# EAGLE board FLYTE 3.01 (EAGLE 9.6.2)
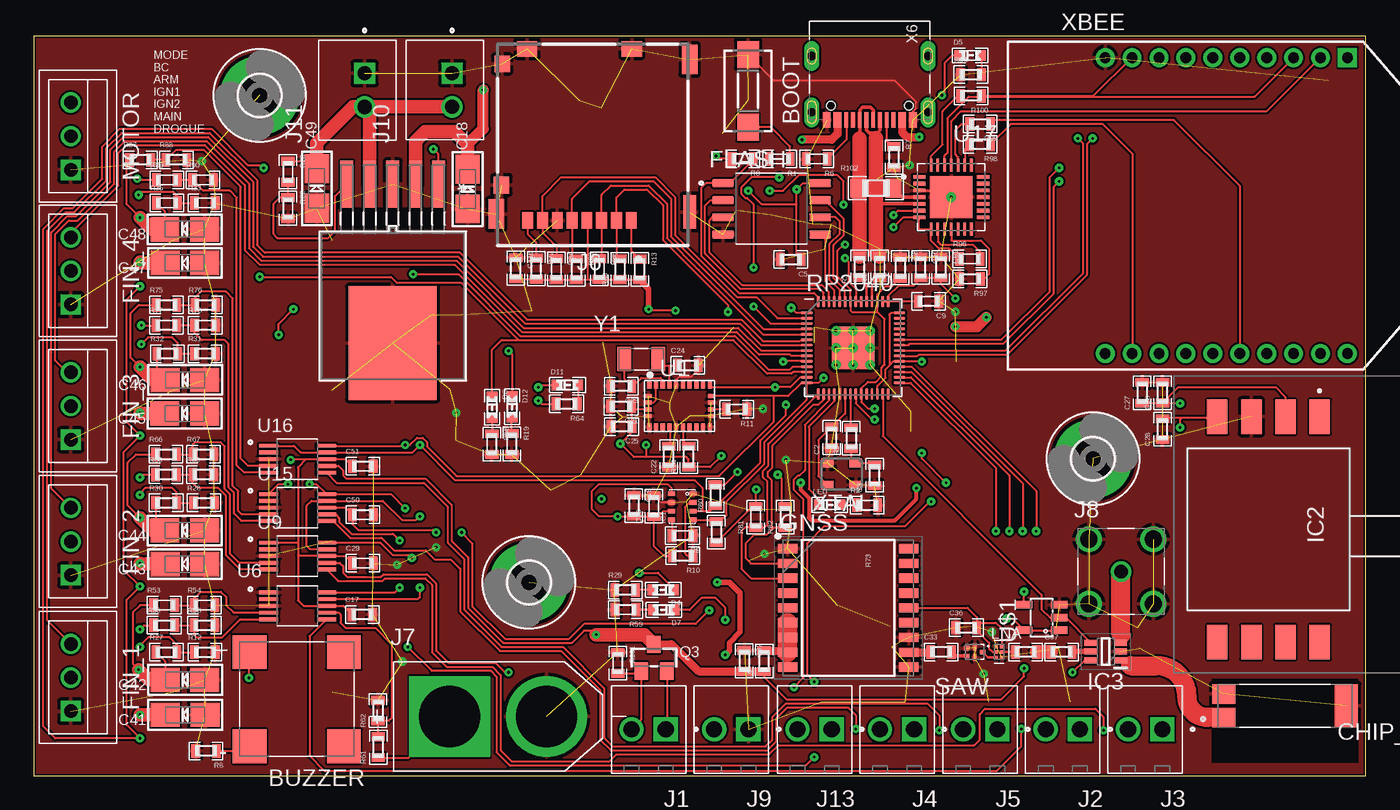
[diagram p7: board, top side]
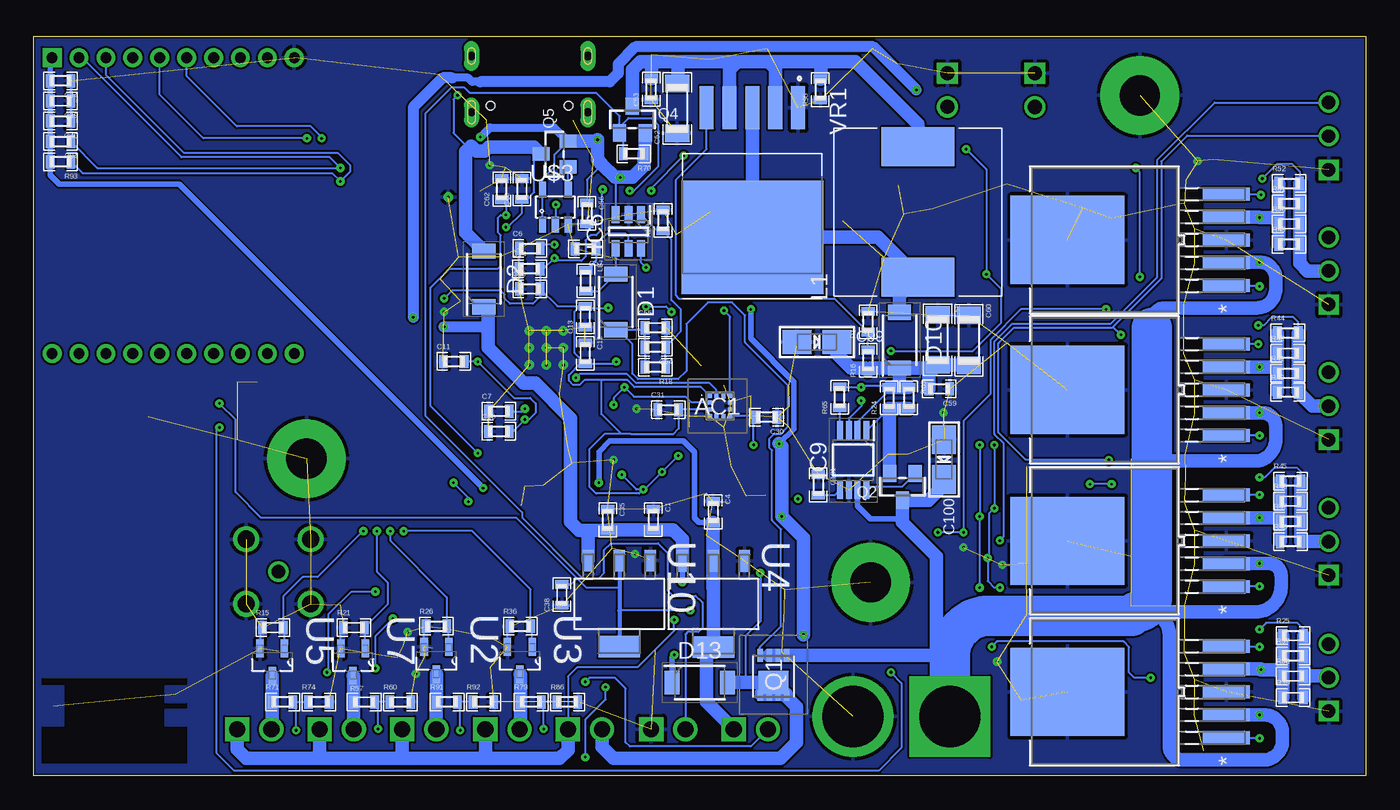
[diagram p8: board, bottom side, seen from below]

Size 99 x 55 mm. Coordinates in mm from the lower left corner, seen from the top.
Outline: 0,0 99,0 99,55 0,55 0,0
Copper layers (1*16): Top 0.075mm / dielectric 1.5mm / Bottom 0.075mm
Design rules "default *": minimum track width 0.149859375mm, minimum drill 0.1mm, track to track 0.149859375mm, track to pad 0.149859375mm, pad to pad 0.149859375mm, via to via 0.149859375mm, smd to smd 0.149859375mm, copper to edge 0.149859375mm, drill to drill 6mil, minimum pad ring 10mil, minimum via ring 8mil, stop-mask expansion 4mil, vias tented up to drill 0mil, thermal gap 10mil
Net classes: 1 power: width 0.305 mm

## Footprints (pad centres in the part's own frame; a part is rotated, then mirrored left to right if it is on the bottom)
KX1341211 = smd 0.35 x 0.3: 1 -0.762,0.75; 2 -0.762,0.25; 3 -0.762,-0.25; 4 -0.762,-0.75; 7 0.762,-0.75; 8 0.762,-0.25; 9 0.762,0.25; 10 0.762,0.75 | smd 0.3 x 0.35: 5 -0.25,-0.75; 6 0.25,-0.75; 11 0.25,0.75; 12 -0.25,0.75
DTSM-3 = smd 2 x 1.6: 1 -2.7,0; 2 2.7,0
CUI_CMT-8530S-SMT = smd 2.5 x 2.5: 1 -3.5,3.5; 2 -3.5,-3.5; N 3.5,3.5; P 3.5,-3.5
0603 = smd 0.65 x 1: 1 -0.775,0; 2 0.775,0
EIA3216-18/A-W = smd 2.15 x 1.8: + 1.475,0; - -1.475,0
1206 = smd 1.3 x 1.8: 1 -1.85,0; 2 1.85,0
XCVR_W3010 = smd 1.7 x 1.45: 1 4.55,0.875; 2 4.55,-0.875 | smd 1.7 x 3.2: 3 -4.55,0
SODFL4725X105N = smd 1.12 x 1.72: 1 -2.075,0; 2 2.075,0
0603.LED = smd 0.8 x 0.8: P$1 -0.775,0; P$2 0.775,0
B3B-XH = drill 1 square: P$1 2.5,0 | drill 1: P$2 0,0; P$3 -2.5,0
SOIC127P790X216-8N = smd 1.61 x 0.58: 1 -3.605,1.905; 2 -3.605,0.635; 3 -3.605,-0.635; 4 -3.605,-1.905; 5 3.605,-1.905; 6 3.605,-0.635; 7 3.605,0.635; 8 3.605,1.905
SON110P970X1010X230-18N = smd 1.45 x 0.686: 1 -4.5,4.4; 2 -4.5,3.3; 3 -4.5,2.2; 4 -4.5,1.1; 5 -4.5,0; 6 -4.5,-1.1; 7 -4.5,-2.2; 8 -4.5,-3.3; 9 -4.5,-4.4; 10 4.5,-4.4; 11 4.5,-3.3; 12 4.5,-2.2; 13 4.5,-1.1; 14 4.5,0; 15 4.5,1.1; 16 4.5,2.2; 17 4.5,3.3; 18 4.5,4.4
3,0-PAD = drill 3 pad 5.842: B3,0 0,0
BMP280 = smd 0.35 x 0.5: 1 0.975,-0.8; 2 0.325,-0.8; 3 -0.325,-0.8; 4 -0.975,-0.8; 5 -0.975,0.8; 6 -0.325,0.8; 7 0.325,0.8; 8 0.975,0.8
MPXV5100DP = smd 2.54 x 1.52: 1 8.38,-3.81; 2 8.38,-1.27; 3 8.38,1.27; 4 8.38,3.81; 5 -8.38,3.81; 6 -8.38,1.27; 7 -8.38,-1.27; 8 -8.38,-3.81
SOT65P220X100-6N = smd 0.95 x 0.45: 1 -1.1,0.65; 2 -1.1,0; 3 -1.1,-0.65; 4 1.1,-0.65; 5 1.1,0; 6 1.1,0.65
SOT95P280X145-6N = smd 1.25 x 0.6: 1 -1.25,0.95; 2 -1.25,0; 3 -1.25,-0.95; 4 1.25,-0.95; 5 1.25,0; 6 1.25,0.95
SOP65P490X110-8N = smd 1.4 x 0.45: 1 -2.2,0.975; 2 -2.2,0.325; 3 -2.2,-0.325; 4 -2.2,-0.975; 5 2.2,-0.975; 6 2.2,-0.325; 7 2.2,0.325; 8 2.2,0.975
TE_282834-2 = drill 1.2 square: 1 -1.27,0 | drill 1.2: 2 1.27,0
5031821852 = smd 0.8 x 1.24: 1 -2.85,0.63; 2 -1.75,0.63; 3 -0.65,0.63; 4 0.45,0.63; 5 1.55,0.63; 6 2.65,0.63; 7 3.75,0.63; 8 4.85,0.63 | smd 0.95 x 2.5: 9 -7.195,0 | smd 1.15 x 2.2: 10 7.195,0.15; 15 -7.195,-11.33 | smd 1.16 x 1.25: 11 6.795,-2 | smd 1.16 x 1.2: 12 6.74,-11 | smd 1.5 x 1.15: 13 4.89,-12.125; 14 -2.89,-12.125
AMASS_XT60-M = drill 4.55 pad 6: N 3.6,0 | drill 4.55 pad 6 square: P -3.6,0
LPRS_SMA_CONNECTOR = drill 1: 1 0,0 | drill 1.28: G1 -2.4,2.4; G2 -2.4,-2.4; G3 2.4,-2.4; G4 2.4,2.4
JST_B2B-XH-A(LF)(SN) = drill 1.05 square: 1 1.25,-0.525 | drill 1.05: 2 -1.25,-0.525
INDP125125X600N = smd 2.9 x 5.4: 1 -4.85,0; 2 4.85,0
AMP_BGA725L6E6327FTSA1 = smd 0.25 x 0.25: 1 -0.2,0.4; 2 -0.2,0; 3 -0.2,-0.4; 4 0.2,-0.4; 5 0.2,0; 6 0.2,0.4
SIS862DNT1GE3 = smd 0.99 x 0.405: 1 -1.555,0.992; 2 -1.555,0.332; 3 -1.555,-0.328; 4 -1.555,-0.988 | smd 0.51 x 0.405: 5 1.555,-0.988; 6 1.555,-0.328; 7 1.555,0.332; 8 1.555,0.992 | smd 1.725 x 2.235: 9 0.438,0.002 | smd 0.25 x 0.2: 10 1.175,-1.096; 11 1.175,1.096
SOT23-WIDE = smd 1 x 1.27: 1 -0.95,-1; 2 0.95,-1; 3 0,1
0805 = smd 1.2 x 1.4: 1 -1.3,0; 2 1.3,0
RP2040-QFN-56 = smd 0.875 x 0.2: 1 -3.438,2.6; 2 -3.438,2.2; 3 -3.438,1.8; 4 -3.438,1.4; 5 -3.438,1; 6 -3.438,0.6; 7 -3.438,0.2; 8 -3.438,-0.2; 9 -3.438,-0.6; 10 -3.438,-1; 11 -3.438,-1.4; 12 -3.438,-1.8; 13 -3.438,-2.2; 14 -3.438,-2.6; 29 3.438,-2.6; 30 3.438,-2.2; 31 3.438,-1.8; 32 3.438,-1.4; 33 3.438,-1; 34 3.438,-0.6; 35 3.438,-0.2; 36 3.438,0.2; 37 3.438,0.6; 38 3.438,1; 39 3.438,1.4; 40 3.438,1.8; 41 3.438,2.2; 42 3.438,2.6 | smd 0.2 x 0.875: 15 -2.6,-3.438; 16 -2.2,-3.438; 17 -1.8,-3.438; 18 -1.4,-3.438; 19 -1,-3.438; 20 -0.6,-3.438; 21 -0.2,-3.438; 22 0.2,-3.438; 23 0.6,-3.438; 24 1,-3.438; 25 1.4,-3.438; 26 1.8,-3.438; 27 2.2,-3.438; 28 2.6,-3.438; 43 2.6,3.438; 44 2.2,3.438; 45 1.8,3.438; 46 1.4,3.438; 47 1,3.438; 48 0.6,3.438; 49 0.2,3.438; 50 -0.2,3.438; 51 -0.6,3.438; 52 -1,3.438; 53 -1.4,3.438; 54 -1.8,3.438; 55 -2.2,3.438; 56 -2.6,3.438 | smd 3.2 x 3.2: 57 0,0 | drill 0.2 pad 0.55: 58 -1.275,1.275; 59 0,1.275; 60 1.275,1.275 | drill 0.2 pad 0.6: 61 -1.275,0; 62 0,0; 63 1.275,0; 64 -1.275,-1.275; 65 0,-1.275; 66 1.275,-1.275
FIL_AFS14A04-1575.42-T3 = smd 0.425 x 0.325: A 0.588,0.287; C -0.588,0; E 0.588,-0.287 | smd 0.25 x 0.525: B 0,0.388; D 0,-0.388
LGA28R50P4X10_380X520X100 = smd 0.3 x 0.525: 1 -2.25,1.562; 6 -2.25,-1.562; 7 -1.75,-1.562; 8 -1.25,-1.562; 9 -0.75,-1.562; 10 -0.25,-1.562; 11 0.25,-1.562; 12 0.75,-1.562; 13 1.25,-1.562; 14 1.75,-1.562; 15 2.25,-1.562; 20 2.25,1.562; 21 1.75,1.562; 22 1.25,1.562; 23 0.75,1.562; 24 0.25,1.562; 25 -0.25,1.562; 26 -0.75,1.562; 27 -1.25,1.562; 28 -1.75,1.562 | smd 0.425 x 0.3: 2 -2.312,0.75; 3 -2.312,0.25; 4 -2.312,-0.25; 5 -2.312,-0.75; 16 2.312,-0.75; 17 2.312,-0.25; 18 2.312,0.25; 19 2.312,0.75
SOT91P240X120-3N = smd 1.321 x 0.559: 1 -1.016,0.914; 2 -1.016,-0.914; 3 1.016,0
SOT230 = smd 1.6 x 0.838: 1 -3.2,2.311; 2 -3.2,0; 3 -3.2,-2.311 | smd 1.6 x 3.099: 4 3.2,0
SOP50P490X110-10N = smd 1.47 x 0.28: 1 -2.15,1; 2 -2.15,0.5; 3 -2.15,0; 4 -2.15,-0.5; 5 -2.15,-1; 6 2.15,-1; 7 2.15,-0.5; 8 2.15,0; 9 2.15,0.5; 10 2.15,1
TO-263-5_MCH = smd 0.965 x 3.505: 1 -3.404,-9.055; 2 -1.702,-9.055; 3 0,-9.055; 4 1.702,-9.055; 5 3.404,-9.055 | smd 6.553 x 8.458: 6 0,2.743
QFN50P500X500X100-29N = smd 0.97 x 0.26: 1 -2.37,1.5; 2 -2.37,1; 3 -2.37,0.5; 4 -2.37,0; 5 -2.37,-0.5; 6 -2.37,-1; 7 -2.37,-1.5; 15 2.37,-1.5; 16 2.37,-1; 17 2.37,-0.5; 18 2.37,0; 19 2.37,0.5; 20 2.37,1; 21 2.37,1.5 | smd 0.26 x 0.97: 8 -1.5,-2.37; 9 -1,-2.37; 10 -0.5,-2.37; 11 0,-2.37; 12 0.5,-2.37; 13 1,-2.37; 14 1.5,-2.37; 22 1.5,2.37; 23 1,2.37; 24 0.5,2.37; 25 0,2.37; 26 -0.5,2.37; 27 -1,2.37; 28 -1.5,2.37 | smd 3.15 x 3.15: 29 0,0 | drill 0.2: P$1 0,0
SOT23-5 = smd 0.55 x 1.2: 1 -0.95,-1.3; 2 0,-1.3; 3 0.95,-1.3; 4 0.95,1.3; 5 -0.95,1.3
DPAK170P1435X465-6N = smd 3.21 x 1.05: 1 -6.13,3.4; 2 -6.13,1.7; 3 -6.13,0; 4 -6.13,-1.7; 5 -6.13,-3.4 | smd 8.46 x 10.53: 6 3.5,0
USB_C_CUSB31-CFM2AX-01-X = smd 0.575 x 1.15: A1B12 -3.2,3.545; A4B9 -2.4,3.545; B1A12 3.2,3.545; B4A9 2.4,3.545 | smd 0.275 x 1.15: A5 -1.25,3.545; A6 -0.25,3.545; A7 0.25,3.545; A8 1.25,3.545; B5 1.75,3.545; B6 0.75,3.545; B7 -0.75,3.545; B8 -1.75,3.545 | drill 0.6 pad 1 long: M1 -4.32,2.97; M2 4.32,2.97; M3 -4.32,-1.21; M4 4.32,-1.21 | hole 0.65: 2.89,2.47; -2.89,2.47
DIP2200W51P200L3294H279Q20P = drill 0.8 pad 1.4 square: 1 -11,8.75 | drill 0.8 pad 1.4: 2 -11,6.75; 3 -11,4.75; 4 -11,2.75; 5 -11,0.75; 6 -11,-1.25; 7 -11,-3.25; 8 -11,-5.25; 9 -11,-7.25; 10 -11,-9.25; 11 11,-9.25; 12 11,-7.25; 13 11,-5.25; 14 11,-3.25; 15 11,-1.25; 16 11,0.75; 17 11,2.75; 18 11,4.75; 19 11,6.75; 20 11,8.75
ASE = smd 0.9 x 0.65: 1 -1.05,-0.825; 2 1.05,-0.825; 3 1.05,0.825; 4 -1.05,0.825
XTAL_FC-135_32.7680KA-A0 = smd 1 x 1.8: 1 -1.25,0; 2 1.25,0

## Placement (x,y rotation side)
AC1  KX134-1211  [KX1341211]  48,27.5 0 bottom
BOOT  DTSM-3  [DTSM-3]  53.09,50.92 270 top
BUZZER  BUZZER  [CUI_CMT-8530S-SMT]  19.55,5.71 180 top
C1  [0603]  52.95,19.06 270 bottom
C2  24 pF  [0603]  59.29,25.16 90 top
C3  24 pF  [0603]  62.49,22.35 90 top
C4  [0603]  48.5,19.63 270 bottom
C5  100 nF  [0603]  56.26,38.39 180 top
C6  100 nF  [0603]  62.13,39.21 0 bottom
C7  100 nF  [0603]  64.42,27.11 0 bottom
C8  1 uF  [0603]  64.41,37.79 270 top
C9  100 nF  [0603]  66.5,35.29 180 top
C10  1 uF  [0603]  65.91,37.81 270 top
C11  100 nF  [0603]  67.78,30.81 0 bottom
C12  100 nF  [0603]  58.01,31.43 270 bottom
C13  100 nF  [0603]  58.01,34.14 90 bottom
C14  100 nF  [0603]  62.15,37.71 0 bottom
C15  100 nF  [0603]  62.14,36.21 0 bottom
C16  100 nF  [0603]  64.43,25.61 0 bottom
C17  0.1 uF  [0603]  24.42,12.01 0 top
C18  10uF  [EIA3216-18/A-W]  32.25,43.63 90 top
C19  100 nF  [0603]  44.61,20.09 270 top
C20  100 nF  [0603]  46.08,20.06 90 top
C21  100 nF  [0603]  43.65,27.48 180 top
C22  100 nF  [0603]  47.18,23.74 90 top
C23  25 pF  [0603]  43.67,28.98 180 top
C24  25 pF  [0603]  48.62,30.52 0 top
C25  100 nF  [0603]  43.69,25.98 180 top
C26  1 uF  [0603]  83.88,28.5 90 top
C27  10 nF  [0603]  82.38,28.49 90 top
C28  470 pF  [0603]  83.88,25.78 90 top
C29  0.1 uF  [0603]  24.47,15.82 0 top
C30  0.1 uF  [0603]  44.54,26.68 180 bottom
C31  0.1 uF  [0603]  51.85,27.22 0 bottom
C32  10 nF  [0603]  52.82,8.56 270 top
C33  120 pF  [0603]  67.43,9.22 0 top
C34  47pF  [0603]  97,51.68 180 bottom
C35  [0603]  56.35,19.04 270 bottom
C36  1 nF  [0603]  69.31,11.02 0 top
C37  120 pF  [0603]  76.4,9.22 0 top
C38  [0603]  59.75,13.47 90 bottom
C39  1uF  [0603]  97,50.18 180 bottom
C40  10uF  [0603]  97,48.68 180 bottom
C41  10uF  [EIA3216-18/A-W]  11.26,4.55 180 top
C42  10 uF  [EIA3216-18/A-W]  11.25,7.15 180 top
C43  10uF  [EIA3216-18/A-W]  11.24,15.75 180 top
C44  10 uF  [EIA3216-18/A-W]  11.23,18.25 180 top
C45  10uF  [EIA3216-18/A-W]  11.22,26.95 180 top
C46  10 uF  [EIA3216-18/A-W]  11.25,29.44 180 top
C47  10uF  [EIA3216-18/A-W]  11.24,38.14 180 top
C48  10 uF  [EIA3216-18/A-W]  11.23,40.64 180 top
C49  10 uF  [EIA3216-18/A-W]  21.04,43.68 90 top
C50  0.1 uF  [0603]  24.47,19.42 0 top
C51  0.1 uF  [0603]  24.46,23.02 0 top
C52  100 uF  [1206]  51.18,49.63 90 bottom
C53  1 uF  [0603]  53.12,51.05 90 bottom
C54  10 pF  [0603]  52.8,31.88 180 bottom
C55  1 uF  [0603]  52.8,33.32 0 bottom
C56  1 uF  [0603]  57.88,41.82 270 bottom
C57  4.7 uF  [0603]  57.99,39.18 180 bottom
C58  100 uF  [1206]  31.82,32.42 270 bottom
C59  1 uF  [0603]  31.7,28.78 180 bottom
C60  100 uF  [1206]  29.5,32.39 270 bottom
C61  100 nF  [0603]  67.42,37.81 270 top
C62  4.7 uF  [0603]  64.22,43.62 90 bottom
C63  1 uF  [0603]  62.72,43.63 90 bottom
C99  10uF  [EIA3216-18/A-W]  40.79,32.26 0 bottom
C100  10uF  [EIA3216-18/A-W]  31.35,23.52 270 bottom
C101  0.1 uF  [0603]  40.68,21.64 270 bottom
C115  1 uF  [0603]  35.82,37.75 270 top
CHIP_ANT  W3010  [XCVR_W3010]  93,5.22 180 top
D1  RSX501LAM20TR  [SODFL4725X105N]  55.74,35.24 90 bottom
D2  RSX501LAM20TR  [SODFL4725X105N]  65.54,36.95 90 bottom
D4  [0603.LED]  46.79,13.84 180 top
D5  [0603.LED]  69.6,53.56 0 top
D6  [0603.LED]  34.06,27.41 270 top
D7  [0603.LED]  46.82,12.34 180 top
D10  RSX501LAM20TR  [SODFL4725X105N]  34.65,32.39 90 bottom
D11  [0603.LED]  39.67,29.06 0 top
D12  [0603.LED]  35.56,27.44 270 top
D13  RSX501LAM20TR  [SODFL4725X105N]  49.5,6.95 0 bottom
FIN_1  03-JST-B3B-XH-A  [B3B-XH]  2.76,7.32 270 top
FIN_2  03-JST-B3B-XH-A  [B3B-XH]  2.76,17.43 270 top
FIN_3  03-JST-B3B-XH-A  [B3B-XH]  2.76,27.5 270 top
FIN_4  03-JST-B3B-XH-A  [B3B-XH]  2.76,37.55 270 top
FLASH  W25Q128JVSIQ  [SOIC127P790X216-8N]  54.84,42.16 0 top
GNSS  TESEO-LIV3F  [SON110P970X1010X230-18N]  60.53,12.5 0 top
H2  MOUNT-PAD-ROUND3.0  [3,0-PAD]  16.8,50.59 0 top
H3  MOUNT-PAD-ROUND3.0  [3,0-PAD]  36.81,14.39 0 top
H4  MOUNT-PAD-ROUND3.0  [3,0-PAD]  78.72,23.59 0 top
IC1  BMP280  [BMP280]  48.2,20.01 90 top
IC2  MPXV5100DP  [MPXV5100DP]  91.76,18.33 90 top
IC3  AS179-92LF  [SOT65P220X100-6N]  79.67,9.25 180 top
IC6  MAX8574EUT+T  [SOT95P280X145-6N]  54.8,40.47 270 bottom
IC9  MCP73844-840I_MS  [SOP65P490X110-8N]  38.1,23.48 270 bottom
J1  282834-2  [TE_282834-2]  45.7,3.47 180 top
J2  282834-2  [TE_282834-2]  76.48,3.47 180 top
J3  282834-2  [TE_282834-2]  82.6,3.47 180 top
J4  282834-2  [TE_282834-2]  64.16,3.47 180 top
J5  282834-2  [TE_282834-2]  70.35,3.47 180 top
J6  503182-1852  [5031821852]  41.56,41.93 180 top
J7  XT60-M  [AMASS_XT60-M]  34.51,4.42 0 top
J8  SMA_CONNECTOR  [LPRS_SMA_CONNECTOR]  80.81,15.2 0 top
J9  282834-2  [TE_282834-2]  51.84,3.47 180 top
J10  B2B-XH-A(LF)(SN)  [JST_B2B-XH-A(LF)(SN)]  30.57,50.99 90 top
J11  B2B-XH-A(LF)(SN)  [JST_B2B-XH-A(LF)(SN)]  24.07,50.98 90 top
J13  282834-2  [TE_282834-2]  58.03,3.47 180 top
L1  33 uH  [INDP125125X600N]  33.29,41.92 90 bottom
L6  27 nH  [0603]  54.28,8.54 90 top
L7  5.6 nH  [0603]  73.73,9.22 0 top
L8  22 uH  [0603]  57.98,36.82 270 bottom
LED  [0603.LED]  59.15,20.16 0 top
LNA  BGA725L6  [AMP_BGA725L6E6327FTSA1]  71.74,9.22 0 top
MOTOR  03-JST-B3B-XH-A  [B3B-XH]  2.76,47.56 270 top
Q1  SI7625DN-T1-GE3  [SIS862DNT1GE3]  44.02,7.41 270 bottom
Q2  [SOT23-WIDE]  34.44,21.5 180 bottom
Q3  [SOT23-WIDE]  46.1,8.8 0 top
Q4  [SOT23-WIDE]  54.51,48.8 0 bottom
Q5  [SOT23-WIDE]  60.3,46.24 90 bottom
R0  10k ohm  [0603]  52.69,45.88 180 top
R1  1k ohm  [0603]  55.44,45.87 180 top
R2  60 ohm  [0603]  61.95,20.13 0 top
R3  27.4 ohm  [0603]  61.37,37.84 90 top
R4  27.4 ohm  [0603]  62.87,37.83 90 top
R5  1k ohm  [0603]  60.77,25.12 90 top
R6  5.1k ohm  [0603]  58.19,45.87 180 top
R7  5.1k ohm  [0603]  63.93,46 270 top
R8  100 ohm  [0603]  12.81,1.87 180 top
R9  10k ohm  [0603]  48.22,17.87 180 top
R10  10k ohm  [0603]  48.23,16.37 180 top
R11  10 kohm  [0603]  52.24,27.27 180 top
R12  100k ohm  [0603]  12.72,9.2 0 top
R13  10k ohm  [0603]  45.03,37.65 270 top
R14  10 kohm  [0603]  48.67,23.74 90 top
R15  10k ohm  [0603]  81.23,11.03 0 bottom
R16  365k ohm  [0603]  37,30.89 90 bottom
R17  57.6k ohm  [0603]  37,33.77 90 bottom
R18  100k ohm  [0603]  52.8,30.4 180 bottom
R19  60 ohm  [0603]  35.53,24.68 270 top
R20  10k ohm  [0603]  52.23,41.29 90 bottom
R21  10k ohm  [0603]  75.2,11.03 0 bottom
R22  100k ohm  [0603]  18.9,42.21 270 top
R23  301k ohm  [0603]  18.9,44.92 270 top
R24  0.1 ohm  [0603]  35.43,28.11 90 bottom
R25  0.13 ohm  [0603]  5.4,10.43 0 bottom
R26  10k ohm  [0603]  69.07,11.13 0 bottom
R27  301k ohm  [0603]  9.87,9.2 0 top
R28  100k ohm  [0603]  12.66,20.3 0 top
R29  315 ohm  [0603]  43.96,13.83 0 top
R30  301k ohm  [0603]  9.85,20.3 0 top
R31  100k ohm  [0603]  12.74,31.4 0 top
R32  301k ohm  [0603]  9.93,31.4 0 top
R33  100k ohm  [0603]  12.72,42.6 0 top
R34  158 ohm  [0603]  69.65,52.13 0 top
R35  301k ohm  [0603]  9.91,42.6 0 top
R36  10k ohm  [0603]  62.84,11.13 0 bottom
R37  0.13 ohm  [0603]  5.4,8.93 0 bottom
R38  0.13 ohm  [0603]  5.4,7.43 0 bottom
R39  0.13 ohm  [0603]  5.4,5.83 0 bottom
R40  0.13 ohm  [0603]  5.8,28.53 0 bottom
R41  0.13 ohm  [0603]  5.8,29.93 0 bottom
R42  0.13 ohm  [0603]  5.8,31.43 0 bottom
R43  10k ohm  [0603]  43.57,37.67 90 top
R44  0.13 ohm  [0603]  5.8,32.93 0 bottom
R45  0.13 ohm  [0603]  5.6,21.93 0 bottom
R46  0.13 ohm  [0603]  5.6,20.43 0 bottom
R47  0.13 ohm  [0603]  5.6,18.93 0 bottom
R48  0.13 ohm  [0603]  5.6,17.43 0 bottom
R49  0.13 ohm  [0603]  5.7,39.53 0 bottom
R50  0.13 ohm  [0603]  5.7,41.04 0 bottom
R51  0.13 ohm  [0603]  5.7,42.54 0 bottom
R52  0.13 ohm  [0603]  5.7,44.04 0 bottom
R53  100k ohm  [0603]  9.7,12.7 0 top
R54  140k ohm  [0603]  12.69,12.7 0 top
R55  100k ohm  [0603]  9.7,11.2 0 top
R56  140k ohm  [0603]  12.69,11.2 0 top
R57  100k ohm  [0603]  74.44,5.5 0 bottom
R58  60 ohm  [0603]  34.04,24.67 270 top
R59  315 ohm  [0603]  43.98,12.36 180 top
R60  140k ohm  [0603]  71.75,5.5 0 bottom
R61  100k ohm  [0603]  25.6,2.14 90 top
R62  140k ohm  [0603]  25.59,4.86 90 top
R63  0.1 ohm  [0603]  33.96,28.11 270 bottom
R64  158 ohm  [0603]  39.6,27.66 180 top
R65  100k ohm  [0603]  39.11,28.15 90 bottom
R66  100k ohm  [0603]  9.84,23.91 0 top
R67  140k ohm  [0603]  12.63,23.91 0 top
R68  100k ohm  [0603]  9.82,22.41 0 top
R69  140k ohm  [0603]  12.61,22.41 0 top
R70  10k ohm  [0603]  54.41,46.26 180 bottom
R71  100k ohm  [0603]  80.5,5.51 0 bottom
R72  10k ohm  [0603]  37.34,37.72 270 top
R73  10k ohm  [0603]  50.74,18.13 270 top
R74  140k ohm  [0603]  77.81,5.51 0 bottom
R75  100k ohm  [0603]  9.88,35.01 0 top
R76  140k ohm  [0603]  12.77,35.01 0 top
R77  100k ohm  [0603]  9.86,33.51 0 top
R78  140k ohm  [0603]  12.75,33.51 0 top
R79  100k ohm  [0603]  62.04,5.51 0 bottom
R80  10k ohm  [0603]  50.66,20.86 90 top
R81  10k ohm  [0603]  53.66,19.25 90 top
R82  10k ohm  [0603]  55.86,19.24 90 top
R83  10k ohm  [0603]  40.34,37.67 270 top
R84  10k ohm  [0603]  38.84,37.68 270 top
R85  10k ohm  [0603]  42.04,37.69 270 top
R86  140k ohm  [0603]  59.33,5.51 0 bottom
R87  100k ohm  [0603]  7.92,45.81 0 top
R88  140k ohm  [0603]  10.61,45.81 0 top
R89  100k ohm  [0603]  9.9,44.31 0 top
R90  140k ohm  [0603]  12.59,44.31 0 top
R91  100k ohm  [0603]  68.28,5.51 0 bottom
R92  140k ohm  [0603]  65.57,5.51 0 bottom
R93  10k ohm  [0603]  97,45.66 180 bottom
R94  10k ohm  [0603]  97,47.16 180 bottom
R95  10k ohm  [0603]  40.54,51.02 90 bottom
R96  10k ohm  [0603]  69.57,38.44 0 top
R97  [0603]  69.58,36.95 180 top
R98  0 ohm  [0603]  70.34,46.96 180 top
R99  0 ohm  [0603]  70.35,48.46 180 top
R100  0 ohm  [0603]  69.66,50.56 180 top
R101  10k ohm  [0603]  43.4,8.4 270 top
R102  [0805]  62.6,43.7 0 top
RP2040  RP2040-QFN56  [RP2040-QFN-56]  60.9,31.83 0 top
SAW  SAW_FILTER  [FIL_AFS14A04-1575.42-T3]  69.93,9.22 180 top
U1  BNO055  [LGA28R50P4X10_380X520X100]  48,27.5 0 top
U2  CJ3400  [SOT91P240X120-3N]  69.07,8.58 270 bottom
U3  CJ3400  [SOT91P240X120-3N]  62.87,8.58 270 bottom
U4  LM1117-3.3  [SOT230]  48.48,12.79 270 bottom
U5  CJ3400  [SOT91P240X120-3N]  81.27,8.48 270 bottom
U6  ADS1115IDGSR  [SOP50P490X110-10N]  19.61,12.65 0 top
U7  CJ3400  [SOT91P240X120-3N]  75.27,8.48 270 bottom
U8  MIC29302WU-TR  [TO-263-5_MCH]  19.43,6.25 90 bottom
U9  ADS1115IDGSR  [SOP50P490X110-10N]  19.61,16.35 0 top
U10  LM1117-3.3  [SOT230]  55.48,12.81 270 bottom
U11  MIC29302WU-TR  [TO-263-5_MCH]  19.43,17.48 90 bottom
U12  MIC29302WU-TR  [TO-263-5_MCH]  19.43,28.71 90 bottom
U13  MIC29302WU-TR  [TO-263-5_MCH]  19.43,39.85 90 bottom
U14  MIC29302WU-TR  [TO-263-5_MCH]  26.68,34.93 180 top
U15  ADS1115IDGSR  [SOP50P490X110-10N]  19.61,19.95 0 top
U16  ADS1115IDGSR  [SOP50P490X110-10N]  19.61,23.55 0 top
U17  CP2102  [QFN50P500X500X100-29N]  68.19,43.03 0 top
U$1  SN74LVC1G04DBVR  [SOT23-5]  74.91,11.78 90 top
U$3  SN74LVC1G04DBVR  [SOT23-5]  60.23,42.29 0 bottom
VR1  XL6009  [DPAK170P1435X465-6N]  45.59,43.54 270 bottom
X6  USB Type C  [USB_C_CUSB31-CFM2AX-01-X]  62.14,52.31 180 top
XBEE  XBP9B-XCST-021  [DIP2200W51P200L3294H279Q20P]  88.88,42.4 270 top
XTAL  ASE  [ASE]  60.04,22.45 180 top
Y1  FC-135_32.7680KA-A0  [XTAL_FC-135_32.7680KA-A0]  45.15,30.99 0 top

## Tracks (layer width: path | path; a pad name or v marks a point on that pad's centre or on a via)
1V1  (via drill 0.2)
  Top 0.15: C8.2 63.8,36.4 63.3,36.4 62.7,35.8 RP2040.45 62.7,34.5 | v60.3,39.5 60.2,39.5 59.75,39.05 59.75,37.12 60.7,36.17 RP2040.50 60.7,34.6 60.8,34.5 62.7,34.5 | v62.5,27.3 62,27.3 61.5,27.8 RP2040.23 61.47,28.42 61.47,28.79 61.98,29.3 62.58,29.3 63,29.72 63,30.34 63.23,30.57 63.23,33.97 62.7,34.5
  Bottom 0.15: C7.2 62.69,27.11 v62.5,27.3 | v60.3,39.5 61.06,39.5 C6.2
3V3  (via drill 0.2)
  Top 0.15: Q3.2 47.05,3.55 J1.1
  Top 0.305: v57,21.8 57,21.3 57.61,20.69 57.61,19.19 57.8,19 64,19 65.6,20.6 v65.6,21.4
  Bottom 0.406: C4.2 49.56,18.85 49.9,19.2 49.9,24.1 50.7,24.9 56.2,24.9 57,24.1 v57,21.8 | v65.6,21.4 88.2,44 97.1,44 97.78,44.67 R93.2 R94.2 C40.2 C39.2 C34.2 97.78,53.25 XBEE.1
  Bottom 1: U4.2 48.48,14 | 48.48,14 U4.4 49,9.07 49,5.5 J1.1 | 48.48,14 48.5,14 C4.2
3V3_OP  (via drill 0.2)
  Top 0.15: RP2040.44 RP2040.43 | C10.2 66,37.03 | 66,37.03 C61.2 67.42,36.58 v68.5,35.5 | RP2040.43 63.5,35.68 64.28,36.47 65.43,36.47 66,37.03 | RP2040.43 63.52,35.29 64.4,35.29 | 64.4,35.29 C9.2 | 64.4,35.29 64.4,34.49 RP2040.42 63.73,34.43 63.59,34.29 63.59,30.51 | RP2040.10 55.73,30.83 v55.7,30.8 | RP2040.1 56.67,34.43 v56.3,34.8 | RP2040.48 RP2040.49 61.1,36.19 60.55,36.75 60.55,38.25 v60.3,38.5 | RP2040.22 61.1,27.7 62.3,26.5 v62.5,26.5 | v66,30.8 65.97,30.83 RP2040.33 63.91,30.83 63.59,30.51 | C115.2 35.85,36.94 R72.2 37.38,36.91 R84.2 38.85,36.89 R83.2 41.2,36.89 | 41.2,36.89 42.02,36.89 R85.2 43.55,36.92 R43.1 45.01,36.89 R13.2 | 41.2,36.89 41.2,41.21 J6.4 | U1.28 46.25,27.95 46.05,27.75 U1.3 U1.4 44.66,27.25 C21.1 44.47,27.44 C25.1 44.47,25.56 v43.6,24.7 44.6,23.7 45.5,23.7 | U16.7 22.65,23.05 23,22.7 23,22.33 23.23,22.1 29.13,22.1 31.07,20.16 31.07,17.48 32.3,16.25 32.3,12.5 34.9,9.9 40,9.9 40.9,10.8 41.5,10.8 v41.8,10.5 | C20.1 44.64,19.28 C19.2 44.59,19.3 v43.4,19.3 42,19.3 41.5,19.8 41.5,21.2 42,21.7 47.1,21.7 47.4,21.4 IC1.8 | IC1.6 46.81,19.69 46.41,19.28 C20.1 | C20.1 46.08,17.12 46.83,16.37 R10.2 | R73.2 53.41,20.03 R81.2 53.66,21.26 v53.7,21.3 | 45.5,23.7 48.5,23.7 48.67,23.53 R14.1 50.27,22.97 v51.1,23.8 | FLASH.8 57.17,44.06 v56.7,43.6 56.7,42.5 | C5.1 56.7,38.72 56.7,42.5 | L6.1 54.28,7.37 55.94,5.7 71.9,5.7 73.6,7.4 v73.6,8 | v72.3,11.7 72.74,11.7 U$1.5 U$1.1 | RP2040.26 62.7,29 63.3,29.6 63.3,30.22 63.59,30.51 | R0.2 50.92,45.88 v50.7,46.1 | v53.1,43.5 54.1,42.5 56.7,42.5 | v45.7,34.7 45.8,34.6 v47.7,34.6 | R80.2 51.33,21.64 v52.3,22.6 | v55.3,22.4 55.56,22.14 55.56,20.31 R82.2
  Top 0.15: v45.5,24.6 45.5,23.7
  Top 0.406: v45.7,34.7 45.7,36.2 R13.2
  Top 0.61: L6.1 54.26,7.78 C32.2 49.42,7.78 47.4,9.8 Q3.3
  Top 1: v41.8,10.5 45.4,10.5 Q3.3
  Bottom 0.15: v55.7,30.8 55.84,30.66 C12.2 | v56.3,34.8 57.89,34.8 C13.2 58.4,34.92 | C15.2 61.38,36.22 C14.2 61.09,37.71 v60.3,38.5 60.1,38.3 58.3,38.3 58,38.6 58,39.8 57.6,40.2 57.2,40.2 56.8,40.6 56.8,43.5 v56.7,43.6 | C11.2 v66,30.8 63.3,28.1 62.1,28.1 61.7,27.7 61.7,27 62.2,26.5 v62.5,26.5 63.39,25.61 C16.2 | AC1.7 45.39,26.75 C30.2 45.5,26.5 v45.5,24.6 | AC1.3 51.05,27.25 C31.2 | C15.2 60.07,34.92 58.4,34.92 | C12.2 58.8,31.44 58.8,34.52 58.4,34.92 | AC1.1 49.41,28.9 54.35,28.9 54.88,29.43 56.8,29.43 58.07,29.43 58.43,29.07 58.92,29.07 59.23,29.38 59.23,29.82 58.39,30.66 C12.2 | C15.2 61.36,35.64 61.9,35.1 63.6,35.1 64,35.5 64,35.8 64.3,36.1 67.9,36.1 v68.5,35.5 | v73.6,8 73.6,10.4 v72.3,11.7 | v50.7,46.1 53.1,43.7 v53.1,43.5 | AC1.10 47.24,34.14 v47.7,34.6 | v51.1,23.8 v52.3,22.6 53.6,21.3 v53.7,21.3 | v53.7,21.3 54.2,21.3 v55.3,22.4 | v53.7,21.3 54,21 57.2,21 57.7,21.5 57.7,24.3 56.55,25.45 55.35,25.45 54.65,25.45
  Bottom 0.152: C31.2 51.08,25.83 51.5,25.4 54.6,25.4 54.65,25.45 | 55.35,25.45 56.8,26.9 56.8,29.43
  Bottom 0.406: v43.6,24.7 42.5,25.8 42.5,29.3 45.7,32.5 v45.7,34.7
  Bottom 1: v41.8,10.5 41.8,17.7 v43.4,19.3 43.4,24.5 v43.6,24.7
3V3_SET  (via drill 0.2)
  Top 0.15: v63.9,41.7 64.23,42.03 U17.6 | J1.2 45.15,4.19 Q3.1 44.97,7.62 R101.2
  Top 0.152: v58,7 57.49,7.51 57.49,17.3 58.76,18.57 64.77,18.57 66.6,20.4 v66.7,20.4 | v67.8,21.8 66,23.6 v66,24
  Bottom 0.15: C62.1 63.9,42.84 v63.9,41.7
  Bottom 0.152: J1.2 45.7,2.2 54.7,2.2 55,2.5 55,6.5 55.8,7.3 57.7,7.3 v58,7 | v66.7,20.4 66.7,20.7 v67.8,21.8 | v66,24 69.5,27.5 69.5,36.3 68.1,37.7 64.5,37.7 64.3,37.9 64.3,40.2 64.5,40.4 64.5,41.5 64.3,41.7 v63.9,41.7
5V  (via drill 0.2)
  Top 0.15: C27.1 C26.1 | C26.1 85.06,28.9 92.3,28.9 93.03,28.17 IC2.2 | v85.2,27.7 83.91,27.7 C26.1 | C17.1 23,12.65 U6.8 20.05,12.65 19.65,13.05 19.65,16.4 | C29.1 23.17,16.35 U9.8 19.7,16.35 19.65,16.4 | U15.8 23.17,19.95 C50.1 23.69,18.7 24.1,18.3 29.7,18.3 v29.9,18.1 | C51.1 23.16,23.55 U16.8 20.25,23.55 | 20.25,23.55 19.65,22.95 19.65,17.4 | 19.65,17.4 19.65,16.4 | U9.1 19.6,17.35 19.65,17.4 | v31.8,18.1 32.6,17.3 32.6,12.62 35.02,10.2 39.8,10.2 40.9,11.3 49.2,11.3 v50.2,12.3 | v19.1,23.5 19.15,23.55 20.25,23.55 | v18.2,32.8 18.2,33.6 v19.3,34.7
  Bottom 0.15: 55.48,13.98 57.9,13.98 58.62,14.7 | C38.2 59.07,14.24 58.62,14.7 | v31.8,18.1 v29.9,18.1 29.9,26.4 27.9,28.4 27.9,32.42 25.62,34.7 v19.3,34.7 | v50.2,12.3 55.48,12.3 | v85.2,27.7 84,26.5 84,21.1 82.1,19.2 63.12,19.2 58.62,14.7 | MOTOR.P$2 2.8,47.6 13.28,47.6 15.2,45.68 15.2,36.98 18.79,33.39 | 18.79,33.39 18.88,33.3 26.18,33.3 27.3,32.18 27.3,25.52 25.28,23.5 v19.1,23.5 | 18.79,33.39 v18.2,32.8
  Bottom 0.3: U10.2 55.48,13.98 55.48,12.3 U10.4
BC  (via drill 0.2)
  Top 0.15: v60.19,42.47 60.19,44.21 59.7,44.7 56.9,44.7 55.7,43.5 v54.7,43.5
  Bottom 0.15: Q4.1 55.19,47.53 R70.2 | v60.19,42.47 60.23,42.43 U$3.2 | Q4.1 55.46,48.24 54.8,48.9 53.1,48.9 52.6,48.4 52.6,45.3 54.4,43.5 v54.7,43.5 | Q4.1 55.46,49.06 57.17,50.77 66.57,50.77 67,51.2 67.95,51.2 69.9,49.25 69.9,26.8 62.7,19.6 62.7,19.21 58.19,14.7 57,14.7 56.6,15.1 56.6,16.8 56.1,17.3 52.6,17.3 51.9,16.6 51.9,13.8 51.5,13.4 49.8,13.4 49.3,12.9 49.3,11 49.6,10.7 50.4,10.7 50.57,10.53 J9.2
BUZZER  (via drill 0.2)
  Top 0.15: RP2040.17 59.1,27.9 57.3,26.1 57.3,22.73 56.9,22.33 56.78,22.33 56.47,22.02 56.47,21.3 57.18,20.58 57.18,20.52 | v16,7.3 16,9.16 BUZZER.P | v27.8,9.6 29.6,7.8 33.98,7.8 34.4,7.38 34.4,1.78 35.38,0.8 57.4,0.8 v58,1.4
  Top 0.152: v56.5,6.6 57.18,7.28 57.18,20.52
  Bottom 0.15: v16,7.3 17.2,7.3 17.6,7.7 17.6,9.6 18,10 27.4,10 v27.8,9.6 | v58,1.4 58,4.2 56.5,5.7 v56.5,6.6
CAM  (via drill 0.2)
  Top 0.15: U14.1 30.08,46.22 v29.7,46.6 | v28.2,37.3 31.58,37.3 36.16,32.72 52.11,32.72 54.62,30.2 56.2,30.2 56.43,30.43 RP2040.11 | v35.3,31.6 35.56,31.34 D12.P$1
  Bottom 0.15: v35.3,31.6 29.2,31.6 27.1,33.7 27.1,36.2 v28.2,37.3 28.2,45.1 v29.7,46.6
CC1
  Top 0.15: X6.A5 63.39,47.27 R7.1
CC2
  Top 0.15: X6.B5 60.39,47.3 R6.1
CS_SD  (via drill 0.2)
  Top 0.15: R43.2 43.31,38.7 J6.2 43.31,43.01 43.9,43.6 45.58,43.6 46.76,42.42 46.76,39.85 51.6,35 v51.6,34.5 | v53.5,34.9 54.77,33.63 RP2040.3
  Bottom 0.15: v53.5,34.9 52,34.9 v51.6,34.5
CSB
  Top 0.15: IC1.2 48.73,20.33 48.4,20 48.4,16.58 48.61,16.37 R10.1
CTRL  (via drill 0.2)
  Top 0.15: RP2040.12 56.45,30.03 56.32,29.9 54.5,29.9 51.98,32.42 36.04,32.42 | v7.9,36.4 6.9,35.4 6.9,26.3 v7.9,25.3 6.7,24.1 6.7,15.3 v7.9,14.1 6.9,13.1 6.9,3.8 v7.9,2.8 1.6,2.8 0.7,3.7 0.7,40.65 2.25,42.2 2.9,42.2 5.1,44.4 5.1,46.8 6.4,48.1 13.22,48.1 15.92,45.4 16.9,45.4 v17.1,45.2 | v16.8,37.1 26.55,37.1 26.98,36.67 31.78,36.67 36.04,32.42 | D6.P$1 34.06,31.69 34.79,32.42 36.04,32.42
  Bottom 0.15: v7.9,25.3 v7.91,25.31 U12.1 | v7.9,2.8 10.33,2.8 U8.1 | v7.9,14.1 10.35,14.1 U11.1 | v7.9,36.4 10.33,36.4 U13.1 | v16.8,37.1 16.8,44.9 v17.1,45.2
CTS
  Top 0.15: R98.1 72.62,48.46 79.44,48.46 81.63,46.27 XBEE.12
D1  (via drill 0.2)
  Top 0.15: v7.9,10.9 8.2,11.2 R55.1
  Bottom 0.15: R25.2 4.62,10.92 5.1,11.4 7.4,11.4 v7.9,10.9
  Bottom 1: R39.2 R38.2 | R38.2 R37.2 R25.2 | FIN_1.P$2 2.87,7.43 R38.2
D2  (via drill 0.2)
  Top 0.15: v7.9,22.2 8.11,22.41 R68.1
  Bottom 0.15: R45.2 4.83,22.62 5.1,22.9 6.8,22.9 7.5,22.2 v7.9,22.2
  Bottom 1: FIN_2.P$2 R48.2 R47.2 R46.2 R45.2
D3  (via drill 0.2)
  Top 0.15: v8,33.5 R77.1
  Bottom 0.15: R44.2 5.03,33.72 5.4,34.1 7,34.1 7.6,33.5 v8,33.5
  Bottom 1: FIN_3.P$2 4,27.5 R40.2 R41.2 R42.2 R44.2
D4  (via drill 0.2)
  Top 0.15: R89.1 7.79,44.31 v7.7,44.4
  Bottom 0.15: v7.7,44.4 6.6,45.5 5.5,45.5 4.92,44.92 R52.2
  Bottom 1: FIN_4.P$2 4.35,37.55 4.92,38.12 R49.2 R50.2 R51.2 R52.2
D+
  Top 0.254: X6.A6 62.39,49.51 62.2,49.7 61.6,49.7 61.39,49.49 X6.B6 61.39,47.39 61.37,47.37
  Top 1.08: 61.37,47.37 61.37,43.77 R102.1 61.37,43.63 R3.2
D+1
  Top 0.254: R102.2 64.57,43.03 U17.4
D-
  Top 0.254: X6.A7 61.89,48.01 62.1,47.8 62.5,47.8 | 62.5,47.8 62.7,47.8 62.89,47.99 X6.B7 | 62.6,47.4 62.6,47.7 62.5,47.8 | U17.5 62.6,42.53
  Top 1.08: R4.2 62.6,38.87 62.6,42.53 62.6,47.4
DROGUE  (via drill 0.2)
  Top 0.15: RP2040.32 65.24,30.43 74.5,21.17 v74.5,18.2
  Bottom 0.15: U5.1 80.36,10.93 R15.2 80.46,13.34 79,14.8 77.9,14.8 v74.5,18.2
DTR
  Top 0.15: R100.1 78.76,50.56 81.6,53.4 XBEE.9
FB
  Bottom 0.15: R18.1 52.08,30.46 C54.1 50.9,33.06 50.9,34.68 51.6,35.38 51.6,39.89 R20.1 52.64,40.52 IC6.1
FIN_1
  Top 0.15: FIN_1.P$3 1,11.58 1,40.52 2.38,41.9 3.03,41.9 5.4,44.27 5.4,46.67 6.53,47.8 13.1,47.8 16.6,44.3 16.6,39.47 17.17,38.9 31.67,38.9 36.66,33.91 52.61,33.91 54.19,32.33 56.94,32.33 56.96,32.36 57.39,32.36 RP2040.6
FIN_2
  Top 0.15: FIN_2.P$3 1.3,21.39 1.3,40.4 2.5,41.6 3.15,41.6 5.7,44.15 5.7,46.55 6.65,47.5 12.97,47.5 16.3,44.17 16.3,39.35 17.05,38.6 31.55,38.6 36.53,33.61 52.48,33.61 54.06,32.03 RP2040.7
FIN_3
  Top 0.15: FIN_3.P$3 2.5,30 1.6,30.9 1.6,40.27 2.63,41.3 3.28,41.3 6,44.02 6,46.42 6.78,47.2 12.85,47.2 16,44.05 16,39.22 16.92,38.3 31.42,38.3 36.41,33.31 52.36,33.31 54.04,31.63 RP2040.8
FIN_4
  Top 0.15: FIN_4.P$3 2.76,40.36 6.3,43.9 6.3,46.3 6.9,46.9 12.72,46.9 15.7,43.92 15.7,39.1 16.8,38 31.3,38 36.28,33.02 52.23,33.02 53.92,31.33 56.22,31.33 56.32,31.23 RP2040.9
GND  (via drill 0.2)  (196 unrouted)
  Top 0.15: U17.3 67.69,43.53 U17.P$1 | U1.25 47.75,29.45 48,29.7 48.9,29.7 49.39,30.19 C24.2 | IC1.7 46.58,20.33 C20.2 | X6.A1B12 65.34,49.37 65.58,49.61 65.58,50.08 65.6,50.1 64,51.7 55.01,51.7 BOOT.1
  Bottom 0.15: R15.1 82.18,10.85 U5.2 | U7.2 76.18,10.82 R21.1 | U2.2 69.98,10.99 R26.1 | U3.2 63.78,10.96 R36.1 | C40.1 C39.1 C34.1 | v27,15.7 23.95,15.7 U11.6
  other vias: 54.3,16.5 65.1,45.4 71.2,10.7 29.9,17 27.4,8.5 54.2,27.3 12.5,45.7 55.9,23.5 70.6,7.6 68.5,34.5 31.4,27
  pour Top: 0,55 0,0 99,0 99,55
  pour Bottom: 0,55 0,0 99,0 99,55
GPS_RX
  Top 0.15: RP2040.15 54.6,24.69 54.6,23.08 54.2,22.68 54.2,22.2 54.52,21.89 54.52,18.7 54.29,18.48 R81.1 52.88,18.48 52.6,18.2 52.6,15.4 53.3,14.7 GNSS.3
GPS_TX
  Top 0.15: R82.1 54.98,18.47 54.86,18.34 | 54.86,18.34 54.44,17.92 53.53,17.92 52.9,17.3 52.9,16.2 53.3,15.8 GNSS.2 | 54.86,18.34 54.86,21.97 54.56,22.26 54.56,22.61 54.9,22.95 54.9,24.57 57.93,27.6 58.33,27.6 58.7,27.97 RP2040.16
IGN1  (via drill 0.2)
  Top 0.15: RP2040.29 65.17,29.23 71.5,22.9 v71.5,18.2
  Bottom 0.15: U3.1 61.96,11.02 R36.2 62.06,13.87 66.4,18.2 v71.5,18.2
IGN2  (via drill 0.2)
  Top 0.15: RP2040.30 65.19,29.63 72.5,22.32 v72.5,18.2
  Bottom 0.15: U2.1 68.16,10.99 R26.2 68.29,13.3 72.5,17.5 v72.5,18.2
LED
  Top 0.15: RP2040.18 59.5,27.88 57.6,25.98 57.6,21.33 58.38,20.56 LED.P$1
MAIN  (via drill 0.2)
  Top 0.15: RP2040.31 65.22,30.03 73.5,21.75 v73.5,18.2
  Bottom 0.15: U7.1 74.36,10.96 R21.2 72.7,12.76 72.7,14.4 73.5,15.2 v73.5,18.2
MISO
  Top 0.15: R84.1 38.84,39.36 37.81,40.39 J6.7 37.81,43.11 39.2,44.5 46.2,44.5 47.66,43.05 47.66,40.22 52.28,35.6 53.7,35.6 55.27,34.03 RP2040.2
MOS  (via drill 0.2)
  Top 0.15: v45,15.1 46.4,15.1 47.56,13.94 D4.P$1
  Bottom 0.15: v45,15.1 45,11.5 46.1,10.4 46.1,6.97
  Bottom 0.61: Q1.11 42.92,5.96 Q1.8 Q1.7 44,5.85 | 44,5.85 Q1.6 Q1.5 45.12,5.96 Q1.10 | 44,5.85 44.02,5.87 Q1.9
  Bottom 1: Q1.8 42.3,5.13 42.3,2.5 43.5,1.3 55.9,1.3 56.76,2.16 J13.2 | Q1.9 46.1,6.97 47.4,6.97 D13.2
MOSI
  Top 0.15: R85.1 42.21,38.64 J6.3 42.21,43.21 42.9,43.9 45.7,43.9 47.06,42.55 47.06,39.97 49.41,37.61 54.2,32.83 RP2040.5
N$1
  Bottom 0.15: IC6.4 55.75,37.33 | 55.75,37.33 D1.2 | L8.2 57.03,36.05 55.75,37.33
N$2
  Top 0.15: LED.P$2 61.14,20.16 R2.1
N$3
  Top 0.15: R5.1 60.77,23.59 XTAL.1 62.34,23.28 C3.2
N$4
  Top 0.61: GNSS.11 66.63,9.2 C33.1
N$5  (via drill 0.2)
  Top 0.15: R12.1 R27.2 10.64,9.76 10.1,10.3 8.5,10.3 7.9,9.7 v7.9,9.6
  Bottom 0.15: v7.9,9.6 10.32,9.6 U8.5
N$6
  Top 0.15: R8.1 15.71,1.87 BUZZER.N
N$7
  Top 0.15: R19.1 35.53,26.64 D12.P$2
N$8
  Top 0.15: J6.1 44.41,39.05 R13.1
N$9
  Top 0.61: L6.2 55.92,9.31 GNSS.8
  Top 1.45: GNSS.6 arc1 GNSS.7 arc1 GNSS.8
N$10
  Top 0.15: U1.9 47.28,25.91 47.28,24.61 C22.2
N$11
  Top 0.15: U1.17 50.33,27.27 R11.2
N$12
  Top 0.15: J6.8 36.71,40.29 37.34,39.66 R72.1
N$13  (via drill 0.2)
  Top 0.15: R28.1 R30.2 10.62,21.08 10.3,21.4 8.3,21.4 7.9,21 v7.9,20.9
  Bottom 0.15: v7.9,20.9 10.36,20.9 U11.5
N$14  (via drill 0.2)
  Top 0.15: R31.1 R32.2 10.7,32.19 10.3,32.6 8.5,32.6 v8,32.1
  Bottom 0.15: v8,32.1 U12.5
N$15
  Top 0.15: U1.11 48.25,24.94 R14.2
N$16
  Top 0.15: R23.2 R22.1 18.28,42.98 17.8,42.5 17.8,40.3 18.1,40 21.9,40 22.4,40.5 22.4,43.11 U14.5
N$17  (via drill 0.2)
  Top 0.15: R33.1 R35.2 10.69,43.11 10.4,43.4 7.9,43.4 7.8,43.3 v7.8,43.2
  Bottom 0.15: v7.8,43.2 10.32,43.2 U13.5
N$18
  Bottom 1: D10.2 34.65,35.71 L1.1 36.26,40.04 VR1.6 VR1.3
N$19
  Bottom 0.15: R16.2 R17.1 39.5,35.5 51.06,35.5 51.3,35.74 51.3,44.3 48.99,46.61 VR1.5
N$20
  Top 0.15: R55.2 R56.1 11.92,10.48 12.1,10.3 14,10.3 15.35,11.65 U6.5
N$21
  Top 0.15: R53.2 R54.1 11.92,13.22 12.4,13.7 13.9,13.7 14.3,13.3 14.3,12.7 14.85,12.15 U6.4
N$22
  Top 0.2: LNA.5 L7.1
N$23
  Top 1.016: L7.2 arc1 C37.1
N$24
  Top 0.254: SAW.A 68.49,8.93 C33.2
N$25
  Top 0.2: LNA.3 70.92,8.82 SAW.C
N$26
  Top 0.406: IC3.5 77.21,9.25 C37.2
N$27
  Top 0.406: IC3.1 81.1,8.6 81.5,8.2
  Top 1.4: CHIP_ANT.1 87.25,4.34 arc-90 85.7,5.9 85.7,5.96 arc90 83.46,8.2 81.5,8.2
N$28
  Top 0.406: IC3.3 80.77,10.47 80.81,10.51
  Top 1.4: 80.81,10.51 J8.1
N$29  (via drill 0.2)
  Top 0.15: U6.6 20.5,10.39 20.5,1.5 21.6,0.4 71.6,0.4 73.4,2.2 v73.4,3.5
  Bottom 0.15: R60.1 73.6,5.5 | 73.6,5.5 R57.2 | v73.4,3.5 73.4,5.3 73.6,5.5
N$30
  Top 0.15: R61.2 25.59,2.92 R62.1 26.39,4.09 26.6,4.3 26.6,9.8 25.4,11 23.2,11 22.8,11.4 22.8,12 22.65,12.15 U6.7
N$31
  Top 0.15: R66.2 R67.1 11.8,23.97 11.8,24.6 12,24.8 13.9,24.8 14.2,24.5 14.2,21.32 14.6,20.92 14.6,16.52 15.27,15.85 U9.4
N$32
  Top 0.15: R68.2 R69.1 11.83,21.77 12.2,21.4 13.7,21.4 14.3,20.8 14.3,16.4 15.35,15.35 U9.5
N$33  (via drill 0.2)
  Top 0.15: U9.6 22.61,14.5 25.92,14.5 26.12,14.7 29.1,14.7 29.6,14.2 29.6,9.2 30.7,8.1 34.1,8.1 34.7,7.5 34.7,1.9 35.5,1.1 42.8,1.1 43.3,1.6 54.65,1.6 55.35,2.3 69.9,2.3 70.3,2.7 70.3,4.6 70.7,5 78.9,5 79.5,4.4 v79.5,3.4
  Bottom 0.15: R74.1 R71.2 79.5,5.28 v79.5,3.4
N$34
  Top 0.15: R75.2 R76.1 12,35.59 12.4,36 14.3,36 14.8,35.5 14.8,21.57 15.2,21.17 15.2,19.7 15.45,19.45 U15.4
N$35
  Top 0.15: R77.2 R78.1 11.97,32.92 12.5,32.4 14.2,32.4 14.5,32.1 14.5,21.45 14.9,21.05 14.9,19.5 15.45,18.95 U15.5
N$36  (via drill 0.2)
  Top 0.15: U15.6 22.25,18.95 23.5,17.7 25.85,17.7 26.78,16.77 29.13,16.77 29.8,16.1 31,16.1 31.7,15.4 31.7,12.25 34.65,9.3 39.2,9.3 42.1,6.4 42.1,2.7 42.9,1.9 54.52,1.9 55.2,2.58 55.2,4.28 56.01,5.09 60.51,5.09 61.1,4.5 v61.1,3.5
  Bottom 0.15: R86.1 R79.2 61.1,5.34 v61.1,3.5
N$37
  Top 0.15: R87.2 R88.1 10.56,46.53 12.67,46.53 15.4,43.8 15.4,23.6 15.95,23.05 U16.4
N$38
  Top 0.15: R89.2 R90.1 11.81,44.28 12.6,43.5 14.6,43.5 15.1,43 15.1,23.1 15.65,22.55 U16.5
N$39  (via drill 0.2)
  Top 0.15: U16.6 22.51,21.8 29.01,21.8 30.77,20.04 30.77,17.36 32,16.13 32,12.37 34.77,9.6 39.32,9.6 42.4,6.52 42.4,2.82 43.02,2.2 54.4,2.2 54.9,2.7 54.9,4.4 55.9,5.4 66.4,5.4 67.3,4.5 v67.3,3.4
  Bottom 0.15: R92.1 R91.2 67.3,5.3 v67.3,3.4
N$40
  Top 0.15: U17.9 67.19,39.71 67.4,39.5 69.8,39.5 70.34,38.95 R96.2
N$41
  Top 0.15: U17.11 68.19,39.8 70.4,39.8 71,39.2 71,37.3 70.65,36.95 R97.1
N$42
  Top 0.15: R98.2 69.19,46.58 U17.23
N$43
  Top 0.15: U17.24 68.69,46.01 68.49,46.21 68.49,47.99 68.96,48.46 R99.2
N$44
  Bottom 0.15: IC9.1 37.08,25.68 R24.1
  Bottom 1: R63.2 35.4,27.33 | 35.4,27.33 R24.1 | 35.4,27.33 35.4,23.7 35.39,23.69 Q2.2
N$45
  Top 0.15: U17.28 66.69,46.09 67.54,46.94 67.54,49.4 68.7,50.56 R100.2
N$46  (via drill 0.2)
  other vias: 42.2,20.6
N$51
  Bottom 0.15: IC6.5 54.8,40.1 55,40.3 56.4,40.3 57.22,39.48 C57.1 57.22,38.36 L8.1
N$53
  Bottom 0.15: Q1.4 45.01,9.59 43.46,11.14 43.46,18.34 44.12,19 44.12,24.2 44.33,24.4 44.33,25.08 43.97,25.42 43.48,25.42 42.93,25.98 42.93,29.03 46.13,32.23 46.13,34.23 47.1,35.2 48.9,35.2 50.5,33.6 50.5,30.1 51.1,29.5 54.1,29.5 54.5,29.9 54.5,32.1 55.56,33.17 D1.1 53.73,33.17 C55.1 C54.2 R18.2
N$54
  Top 0.15: D4.P$2 44.75,13.84 R29.2
N$55
  Top 0.15: D5.P$2 70.43,53.51 R34.2
N$97
  Top 0.15: D6.P$2 34.06,25.47 R58.1
N$98
  Top 0.15: D7.P$2 44.78,12.34 R59.1
N$105
  Top 0.15: D11.P$2 40.44,27.73 R64.1
N$107  (via drill 0.2)
  Top 0.15: v37.5,27.9 37.74,27.66 R64.2
  Bottom 0.15: v37.5,27.9 37.5,27.5 38.42,26.58 IC9.3
N$108
  Bottom 0.15: IC9.4 39.08,27.34 R65.1
N$109
  Bottom 0.15: Q2.1 34.49,21.5 36.91,21.5 IC9.8
N$110
  Bottom 0.15: IC9.5 39.49,20.86 C101.2
N$121
  Bottom 0.15: U$3.4 59.28,45.27 Q5.1
N_S  (via drill 0.2)
  Top 0.15: U$1.4 v73.6,13.7 | v77.2,7.7 78.1,8.6 IC3.6
  Bottom 0.15: v73.6,13.7 75.4,13.7 77.1,12 77.1,7.8 v77.2,7.7
PYRO_DROGUE
  Bottom 1: J3.2 81.28,3.52 R71.1 U5.3
PYRO_IGN1
  Bottom 1: U3.3 62.81,7.51 R79.1 62.81,3.55 J4.2
PYRO_IGN2
  Bottom 1: J5.2 69.08,5.48 R91.1 69.06,7.55 U2.3
PYRO_MAIN
  Bottom 1: J2.2 R57.1 75.22,7.41 U7.3
QSPI_SCLK
  Top 0.15: RP2040.52 59.9,36.12 59.15,36.87 59.15,39.57 59.9,40.32 59.9,41.2 59.58,41.53 FLASH.6
QSPI_SD0
  Top 0.15: RP2040.53 59.5,36.1 58.85,36.75 58.85,39.85 FLASH.5
QSPI_SD1
  Top 0.15: RP2040.55 58.7,35.92 58.42,36.2 52.52,36.2 49.9,38.82 49.9,42.4 50.3,42.8 FLASH.2
QSPI_SD2
  Top 0.15: FLASH.3 50.42,41.53 50.2,41.3 50.2,38.95 52.65,36.5 58.57,36.5 59.1,35.97 RP2040.54
QSPI_SD3
  Top 0.15: RP2040.51 60.3,36.14 59.44,37 59.44,39.44 60.2,40.2 60.2,41.4 58.81,42.8 FLASH.7
QSPI_SS
  Top 0.15: RP2040.56 58.3,35.6 58,35.9 52.4,35.9 49.6,38.7 49.6,43.7 49.97,44.06 FLASH.1 51.77,44.06 53.47,45.77 R0.1 R1.2
RSSI  (via drill 0.2)
  Top 0.15: RP2040.35 72.23,31.63 78,37.4 78,47 v77.6,47.4
  Bottom 0.15: v77.6,47.4 77.6,47.5 78.4,48.3 83.9,48.3 87.63,52.03 XBEE.6
RTS
  Top 0.15: R99.1 71.43,48.76 84.74,48.76 89.63,43.87 XBEE.16
S
  Top 0.15: IC3.4 76.69,11.78 U$1.2 75.52,11.78 74.9,12.4 74.9,13.47 63.1,25.27 RP2040.27
SCK
  Top 0.15: R83.1 40.01,38.78 J6.5 40.01,42.91 41.3,44.2 46.08,44.2 47.36,42.92 47.36,40.1 54.22,33.23 RP2040.4
SCL  (via drill 0.2)
  Top 0.15: U16.10 27.55,24.55 v27.6,24.6 27.95,24.6 28.48,25.13 28.92,25.13 29.23,24.82 29.23,24.5 31.42,22.3 49.8,22.3 | v27.6,19.9 26.55,20.95 U15.10 21.01,21.7 v20.5,21.7 | U9.10 25.75,17.35 26.7,16.4 27.9,16.4 v28.1,16.2 | U6.10 26.85,13.65 v27.2,14 | U15.1 18.21,21.7 v18.9,21.7 | 55,28.23 56.06,28.23 57.06,29.23 RP2040.14 | 55,28.23 50.33,28.23 U1.19 | RP2040.14 57.46,27.98 54.3,24.82 54.3,23.2 51.5,20.4 51.5,19.4 51,18.91 R73.1 50.61,19.03 IC1.4 | 49.8,22.3 | 55,28.23 55,26.36 50.94,22.3 49.8,22.3 | v58.7,29.6 58.33,29.23 RP2040.14
  Bottom 0.15: v27.6,24.6 v27.6,19.9 28,19.5 28,16.3 v28.1,16.2 28.1,14.5 27.6,14 v27.2,14 | v18.9,21.7 v20.5,21.7 | AC1.12 48.26,28.26 48.26,28.69 48.77,29.2 54.22,29.2 54.92,29.9 58.4,29.9 v58.7,29.6
SDA  (via drill 0.2)
  Top 0.15: U16.1 19.35,24.55 19.85,24.05 U16.9 28.15,24.05 v28.7,24.6 31.3,22 49.1,22 49.7,21.4 49.7,19.69 | v28.7,19.3 28.4,19 27.4,19 25.95,20.45 U15.9 20.65,20.45 20.3,20.1 20.3,17.1 20.55,16.85 U9.9 | U6.9 28.55,13.15 28.7,13.3 v28.7,14 | RP2040.13 56.96,29.63 56.23,28.9 v55.1,28.9 50.41,28.9 U1.20 | v55.9,27.6 55.9,26.84 54,24.94 54,23.32 50.78,20.1 50.67,20.1 R80.1 50.26,19.69 49.7,19.69 | IC1.3 49.7,19.69
  Bottom 0.15: v28.7,24.6 v28.7,19.3 v28.7,14 | v55.9,27.6 55.9,28.1 v55.1,28.9 54.4,28.2 50.56,28.2 50.13,27.78 48.79,27.78 AC1.2
SDO
  Top 0.15: IC1.5 47.44,18.99 R9.2
TEL_RST  (via drill 0.2)
  Top 0.15: RP2040.34 65.68,31.23 65.78,31.33 72.35,31.33 78.3,37.28 78.3,47 v78.7,47.4
  Bottom 0.15: v78.7,47.4 86.4,47.4 89.63,50.63 XBEE.5
TEL_RX  (via drill 0.2)
  Top 0.15: U17.26 67.69,46.1 67.89,46.3 67.89,48.89 69.5,50.5 90.73,50.5 XBEE.3 | RP2040.36 65.03,32.03 65.13,32.13 72.05,32.13 75.8,35.88 75.8,43.8 v76.2,44.2
  Bottom 0.15: XBEE.3 93.63,52.13 87.8,46.3 76.38,46.3 75.47,45.4 75.47,44.93 v76.2,44.2 76.8,44.8 95.37,44.8 R93.1
TEL_TX  (via drill 0.2)
  Top 0.15: U17.25 68.19,48.67 68.92,49.4 91.63,49.4 XBEE.2 | RP2040.37 71.93,32.43 75.5,36 75.5,44.5 v76.2,45.2
  Bottom 0.15: XBEE.2 95.4,53.4 88,46 77,46 v76.2,45.2 94.26,45.2 R94.1
USB+  (via drill 0.2)
  Top 0.15: v55.4,44.5 53.35,44.5 52.57,43.72 52.57,43.28 52.88,42.97 53.03,42.97 53.5,42.5 v53.5,37.8
  Top 0.61: X6.B4A9 59.74,47.74 59.3,47.3 v57.1,47.3 | X6.A4B9 64.54,47.86 64.9,47.5 v65.8,47.5
  Bottom 0.15: 56.75,45.45 57.88,44.32 C56.1 | U$3.1 U$3.5 61.18,44.42 60.3,45.3 60.3,46.19 Q5.2 | v53.5,37.8 53.85,38.15 IC6.6 | v55.4,44.5 55.75,44.15 IC6.3
  Bottom 0.61: v65.8,47.5 65.1,48.2 60.31,48.2 Q5.2
  Bottom 1: Q4.2 53.56,46.33 R70.1 53.64,45.36 54.5,44.5 v55.4,44.5 55.8,44.5 56.75,45.45 57.1,45.8 v57.1,47.3 57.21,47.19 Q5.2
USB_BOOT
  Top 0.15: BOOT.2 54.79,48.22 56.22,46.8 R1.1
USB_BST  (via drill 0.2)
  Top 0.15: v37.5,28.9 37.66,29.06 D11.P$1
  Bottom 0.15: R24.2 35.55,29 | IC9.2 37.78,26.33 35.1,29 35.55,29 | 35.55,29 37.4,29 v37.5,28.9 39.08,28.9 R65.2
  Bottom 1: 32.08,30.31 C58.2 31.79,30.54 C60.2 | 32.08,30.31 D10.1 | D10.1 36.8,30.31 R16.1 37.2,30.31 38.27,30.31 39.31,31.36 C99.+ | R63.1 34.7,28.89 | 34.7,28.89 R24.2 | D10.1 34.65,28.94 34.7,28.89 | C59.2 32.47,29.92 32.08,30.31
USB_CHG
  Bottom 1: VR1.2 43.89,52.59 44.4,53.1 | 44.4,53.1 46.7,53.1 | 46.7,53.1 47.29,52.51 VR1.4 | 46.7,53.1 51.1,53.1 | C52.2 51.1,51.56 51.1,53.1 | 51.1,53.1 53.1,53.1 | 53.1,53.1 53.9,53.1 54.51,52.49 54.51,51.6 54.51,51 Q4.3 | C53.2 53.1,51.84 53.1,53.1 | L1.2 33.29,48.47 37.92,53.1 40.5,53.1 | 40.5,53.1 44.4,53.1 | R95.2 40.5,51.83 40.5,53.1
USB_DM
  Top 0.2: R4.1 62.3,36.48 RP2040.46
USB_DP
  Top 0.2: RP2040.47 61.9,36.5 61.37,37.03 R3.1
V_CAM
  Top 0.15: R23.1 21.04,45.7
  Top 1: U14.4 24.98,49.35 J11.2 | J11.2 24.61,49.74 J10.2 | C49.+ 21.04,45.7 21.04,47.04 23.74,49.74 J11.2
V_FIN_1  (via drill 0.2)
  Top 0.15: R27.1 9.78,8.52 C42.+ | R53.1 7.9,12.7 7.37,12.17 7.37,8.33 v7.8,7.9
  Top 1: C42.+ 8.55,7.15 v7.8,7.9
  Bottom 1: R25.1 R37.1 6.17,8.2 | 6.17,8.2 R38.1 R39.1 | 6.17,8.2 6.47,7.9 v7.8,7.9 7.85,7.95 U8.4
V_FIN_2  (via drill 0.2)
  Top 0.15: R30.1 9.08,18.93 C44.+ | v7.9,19.2 7,20.1 7,23.3 7.61,23.91 R66.1
  Top 1: C44.+ 8.85,18.25 v7.9,19.2
  Bottom 1: R45.1 R46.1 6.38,19.2 | 6.38,19.2 R47.1 R48.1 | 6.38,19.2 v7.9,19.2 10.36,19.2 U11.4
V_FIN_3  (via drill 0.2)
  Top 0.15: R32.1 9.16,30.06 C46.+ | v7.9,30.4 7.2,31.1 7.2,34.4 7.81,35.01 R75.1
  Top 1: C46.+ 8.86,29.44 v7.9,30.4
  Bottom 1: R44.1 R42.1 6.58,30.6 | 6.58,30.6 R41.1 R40.1 | 6.58,30.6 6.78,30.4 v7.9,30.4 U12.4
V_FIN_4  (via drill 0.2)
  Top 0.15: R35.1 9.75,41.98 C48.+ | v7.9,41.5 6.9,42.5 6.9,45.3 7.14,45.55 R87.1
  Top 1: C48.+ 8.76,40.64 v7.9,41.5
  Bottom 1: R52.1 R51.1 6.47,41.7 | 6.47,41.7 R50.1 R49.1 | 6.47,41.7 6.67,41.5 v7.9,41.5 7.95,41.55 U13.4
VBUS  (via drill 0.2)
  Top 0.15: v63.9,40.8 64.63,41.53 U17.7 65.74,41.45 65.74,40.66 U17.8 66.69,39.79 67.28,39.2 68.03,39.2 R96.1 | v67.5,50.6 67.7,50.8 67.7,53 68.26,53.56 D5.P$1
  Bottom 0.15: v63.9,40.8 63.78,40.8 62.72,41.86 C63.1 62.34,42.86 61.8,43.4 61.8,45.8 61.36,46.24 Q5.3 | v67.5,50.6 67.8,50.3 67.8,47.8 66.82,46.83 66.47,46.83
  Bottom 1: Q5.3 61.8,46.74 65.21,46.74 65.5,46.45 66.1,46.45 66.47,46.83 66.9,46.4 66.9,40.39 D2.2
VCC  (via drill 0.2)
  Top 0.406: v51.4,9 51.7,9.3 51.7,9.9 52.5,10.7 52.5,13.6 51.7,14.4 v50.8,14.4
  Top 0.813: 32.25,46.95 33.4,48.1 v33.4,51 | v68.5,33.4 70.1,33.4 v70.8,34.1
  Top 1: U14.2 28.38,47.18 29.1,47.9 31.3,47.9 32.25,46.95 C18.+
  Bottom 0.406: D13.1 51.58,8.83 v51.4,9 | v50.8,14.4 U4.3
  Bottom 0.61: 65.8,51.6 66.4,51.6 66.7,51.9 67.9,51.9
  Bottom 0.813: v33.4,51 36.6,54.2 54.29,54.2 55.57,52.93 55.57,52.23 56.2,51.6 65.8,51.6 | 67.9,51.9 68.6,51.9 70.8,49.7 v70.8,34.1 | v68.5,33.4 65.34,33.4 65.24,33.5
  Bottom 1: D2.1 65.24,34.58 65.24,33.5 65.24,31.84 62.6,29.2 61.7,29.2 59.09,26.59 59.09,18.9 58.46,18.27 57.73,18.27 | U10.3 57.79,18.2 57.73,18.27 | U4.3 50.79,17.59 51.48,18.28 C1.2 56.33,18.28 C35.2 57.73,18.27
VCC_PYRO  (via drill 0.2)
  Top 0.15: 50.67,13.23 49.63,13.23 48.74,12.34 D7.P$1
  Top 0.152: v51.4,11.6 51.4,12.5 50.67,13.23
  Bottom 0.15: v51.4,11.6 51.4,10.8 54.1,8.1 58.6,8.1 59.3,7.4 J13.1
  Bottom 1: J13.1 59.3,1.9 59.9,1.3 65.5,1.3 | J3.1 83.87,1.97 83.2,1.3 77.7,1.3 | 65.5,1.3 71.8,1.3 | 71.8,1.3 77.7,1.3 | J4.1 65.43,1.37 65.5,1.3 | J5.1 71.62,1.48 71.8,1.3 | J2.1 77.75,1.35 77.7,1.3
VCC_RF
  Top 0.15: C36.2 70.1,11.8 69.4,12.5 GNSS.14 | C36.2 70.2,10.91 70.2,10.7 71,9.9 71,9.5 71.28,9.22 LNA.2 | C36.2 70.09,11.12 70.37,11.4 71.5,11.4 71.94,10.96 LNA.6
VOLT_DP  (via drill 0.2)
  Top 0.15: C28.2 83.94,26.61 85.3,26.61 | IC2.4 87.85,26.61 85.3,26.61 | U9.7 22.75,15.85 23,15.6 23,15.1 23.3,14.8 25.8,14.8 26,15 29.22,15 29.9,14.32 29.9,9.32 30.82,8.4 34.32,8.4 35.02,7.7 v35.3,7.7 | v85.2,25.9 85.2,26.51 85.3,26.61
  Bottom 0.15: v35.3,7.7 34.5,6.9 34.5,2.1 36.2,0.4 84.1,0.4 85.4,1.7 85.4,25.7 v85.2,25.9
VOLT_MOTOR  (via drill 0.2)
  Top 0.15: U15.7 22.43,19.45 22.72,19.16 22.72,18.9 23.62,18 26.7,18 v27.2,17.5
  Bottom 0.15: MOTOR.P$3 11.24,50.06 15.5,45.8 15.5,37.1 19,33.6 26.3,33.6 27.6,32.3 27.6,25.4 26.9,24.7 26.9,17.8 v27.2,17.5
XIN
  Top 0.15: RP2040.20 60.3,26.94 C2.2 58.31,24.96 58.31,22.3 XTAL.3
XIN32
  Top 0.15: Y1.1 43.9,29.53 C23.1 44.55,28.98 45.17,29.6 46.6,29.6 46.75,29.45 U1.27
XOUT
  Top 0.15: RP2040.21 60.7,25.97 R5.2
XOUT32
  Top 0.15: Y1.2 46.87,30.52 47.3,30.52 | 47.3,30.52 C24.1 | U1.26 47.25,30.47 47.3,30.52
XT60+  (via drill 0.2)
  Top 0.15: R61.1 27.86,1.37 J7.P
  Top 1: C41.+ v7.91,4.55 | C43.+ 7.95,15.75 v7.9,15.8 | C45.+ 7.95,26.95 v7.9,27 | C47.+ 7.96,38.14 v7.9,38.2
  Bottom 0.406: IC9.7 37.78,20.08 36.8,19.1 34.44,19.1
  Bottom 1: 16.3,12.2 8.2,12.2 arc-90 6.3,14.1 6.3,14.9 arc-90 7.2,15.8 v7.9,15.8 10.35,15.8 U11.2 | 16.3,12.2 17.1,12.2 | 15.9,23.4 8.3,23.4 arc-90 6.7,25 6.7,26 arc-90 7.7,27 v7.9,27 U12.2 | U13.2 10.32,38.2 v7.9,38.2 arc90 6.7,37 6.7,36.2 arc90 8.1,34.8 14.9,34.8 arc-90 15.9,33.8 15.9,33.3 | U8.2 v7.91,4.55 7.55,4.55 arc90 6.2,3.2 6.2,2.6 arc90 7.6,1.2 13.6,1.2 arc90 14.6,2.2 14.6,10.5 arc-90 16.3,12.2 | C100.+ 31.35,21.64 32.5,20.5 Q2.3 34.44,19.1 34.44,18.84 31.91,16.31 31.91,9.16 32.1,8.97 | 32.1,8.97 30.67,8.97 30.4,8.7 30.4,4.93 J7.P | Q1.1 arc1 Q1.2 | Q1.2 arc1 Q1.3 | 32.1,8.97 Q1.2
  Bottom 3: 15.9,33.3 15.9,23.4 15.9,13.4 arc90 17.1,12.2 17.4,11.9 28,11.9 arc-90 30.91,8.99 J7.P

## Text on the board
tPlace: MODE / BC / ARM / IGN1 / IGN2 / MAIN / DROGUE